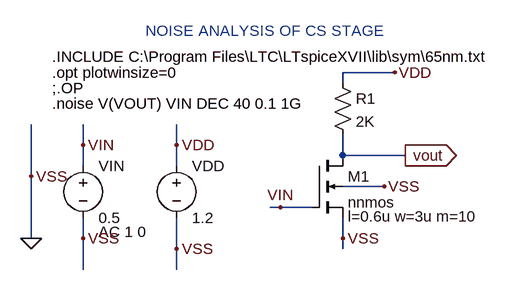
[diagram p0: schematic 10NOISE ANALYSIS OF CS STAGE.asc]
10NOISE ANALYSIS OF CS STAGE.asc, the LTspice schematic file:
Version 4
SHEET 1 880 680
WIRE 384 16 304 16
WIRE 304 32 304 16
WIRE -96 128 -96 96
WIRE 48 128 48 96
WIRE 304 144 304 112
WIRE 400 144 304 144
WIRE -96 160 -96 128
WIRE 48 160 48 128
WIRE -176 176 -176 96
WIRE 368 192 304 192
WIRE 208 224 192 224
WIRE 256 224 208 224
WIRE -176 272 -176 176
WIRE -96 272 -96 240
WIRE 304 272 304 240
WIRE 48 288 48 240
WIRE 304 288 304 272
WIRE -96 320 -96 272
WIRE 48 320 48 288
FLAG 400 144 vout
IOPIN 400 144 Out
FLAG -176 272 0
FLAG -176 176 VSS
FLAG -96 272 VSS
FLAG 48 288 VSS
FLAG 368 192 VSS
FLAG 304 272 VSS
FLAG 48 128 VDD
FLAG 384 16 VDD
FLAG -96 128 VIN
FLAG 208 224 VIN
SYMBOL nmos4 256 144 R0
WINDOW 123 56 94 Left 2
SYMATTR Value2 l=0.6u w=3u m=10
SYMATTR InstName M1
SYMATTR Value nnmos
SYMBOL res 288 16 R0
SYMATTR InstName R1
SYMATTR Value 2K
SYMBOL voltage 48 144 R0
SYMATTR InstName VDD
SYMATTR Value 1.2
SYMBOL voltage -96 144 R0
WINDOW 123 24 118 Left 2
WINDOW 39 0 0 Left 0
SYMATTR Value2 AC 1 0
SYMATTR InstName VIN
SYMATTR Value 0.5
TEXT -144 -8 Left 2 !.INCLUDE C:\\Program Files\\LTC\\LTspiceXVII\\lib\\sym\\65nm.txt
TEXT -144 16 Left 2 !.opt plotwinsize=0
TEXT -144 40 Left 2 !;.OP
TEXT 0 -48 Left 2 ;NOISE ANALYSIS OF CS STAGE
TEXT -144 64 Left 2 !.noise V(VOUT) VIN DEC 40 0.1 1G

The netlist it stands for:
* 10NOISE ANALYSIS OF CS STAGE.asc
M1 vout VIN 0 0 nnmos l=0.6u w=3u m=10
R1 VDD vout 2K
VDD VDD 0 1.2
VIN VIN 0 0.5 AC 1 0
.model NMOS NMOS
.model PMOS PMOS
.lib standard.mos
.INCLUDE C:\Program Files\LTC\LTspiceXVII\lib\sym\65nm.txt
.opt plotwinsize=0
;.OP
* NOISE ANALYSIS OF CS STAGE
.noise V(VOUT) VIN DEC 40 0.1 1G
.backanno
.end